# EasyEDA schematic 1-Schematic.json
TITLE: 5v 800mA USB wall wart; REV: 1.0; Date: 2017-09-17; Sheet: 1/1; Drawn By: tardate
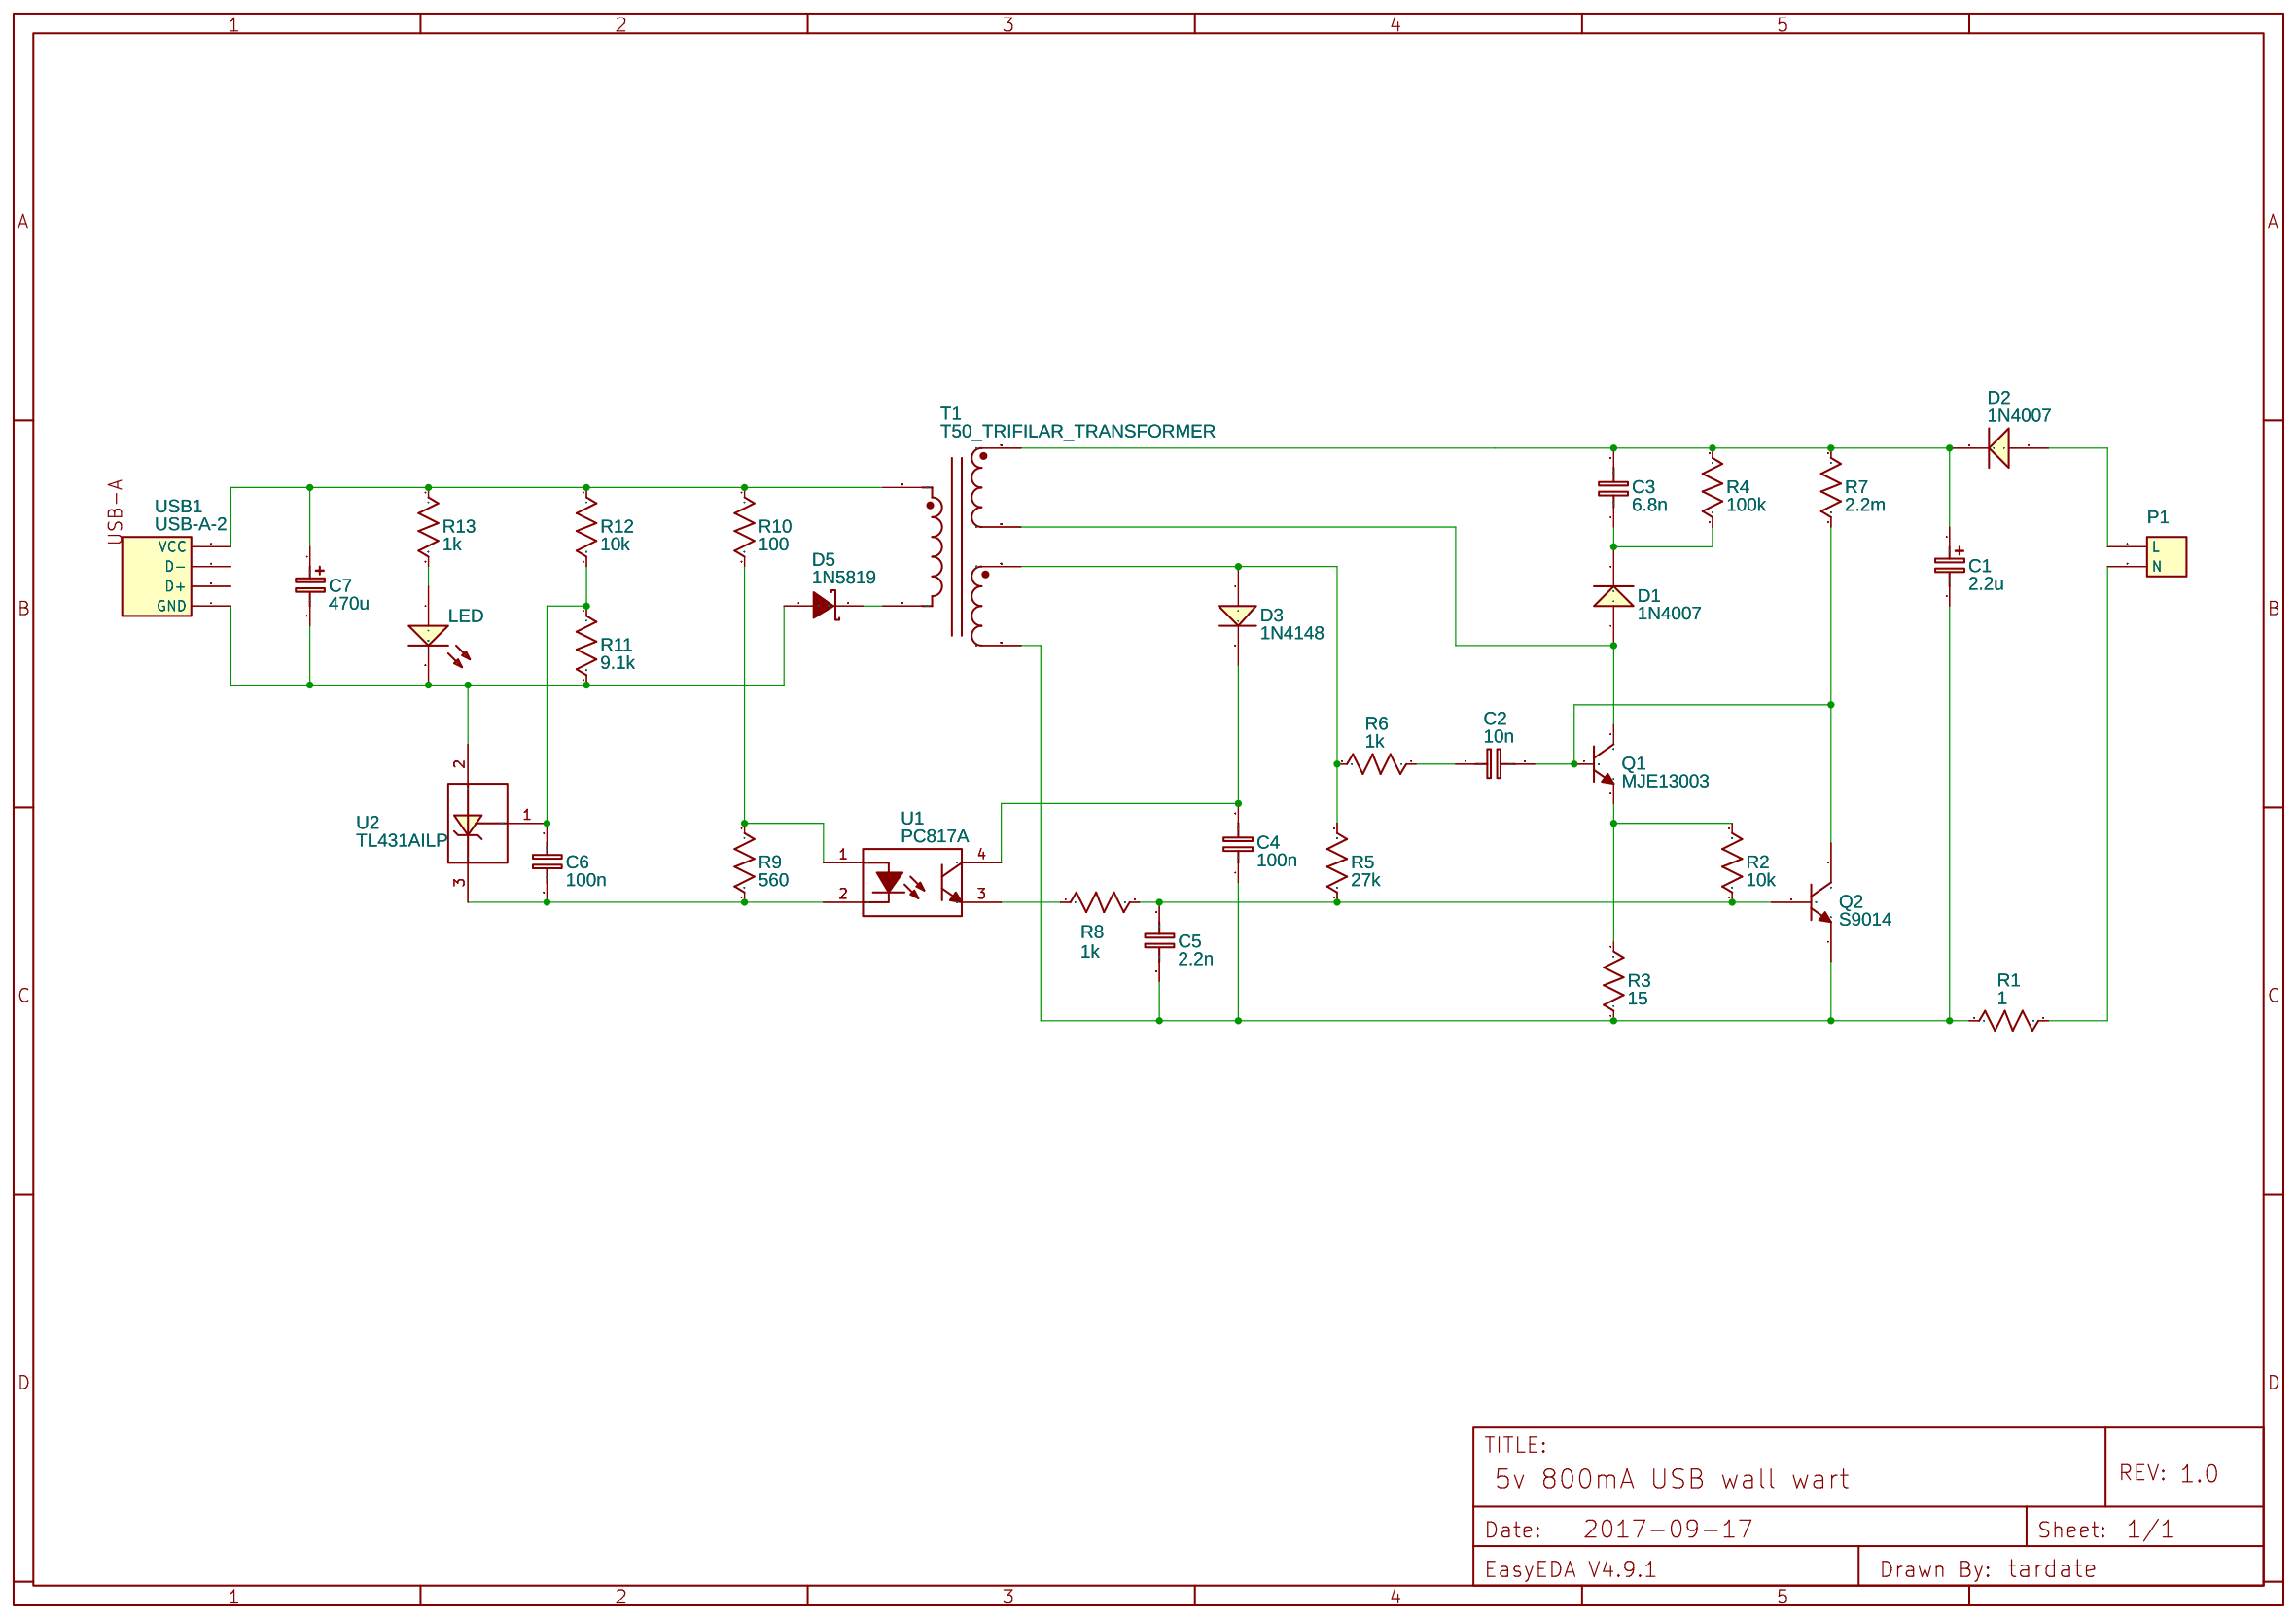
[diagram p0: schematic sheet]

## Parts
C1  2.2u  [CAP-D3.0XF1.5]
C2  10n  [RAD-0.1]
C3  6.8n  [RAD-0.1]
C4  100n  [RAD-0.1]
C5  2.2n  [RAD-0.1]
C6  100n  [RAD-0.1]
C7  470u  [CAP-D3.0XF1.5]
D1  1N4007  [DO-41]
D2  1N4007  [DO-41]
D3  1N4148  [DO-35]
D5  1N5819  [DO-41]
LED  204-10UYC/S530-A3  [LED-3MM/2.54]
P1  Header-Female-2.54_1x2  [HDR-1X2/2.54]
Q1  MJE13003  [TO-126]
Q2  S9014  [TO-92(TO-92-3)]
R1  1  [AXIAL-0.3]
R2  10k  [AXIAL-0.3]
R3  15  [AXIAL-0.3]
R4  100k  [AXIAL-0.3]
R5  27k  [AXIAL-0.3]
R6  1k  [AXIAL-0.3]
R7  2.2m  [AXIAL-0.3]
R8  1k  [AXIAL-0.3]
R9  560  [AXIAL-0.3]
R10  100  [AXIAL-0.3]
R11  9.1k  [AXIAL-0.3]
R12  10k  [AXIAL-0.3]
R13  1k  [AXIAL-0.3]
T1  T50_TRIFILAR_TRANSFORMER  [T50_TRIFILAR_TRANSFORMER]
U1  PC817A  [DIP-4]
U2  TL431AILP  [TO92-INLINE]
USB1  USB-A-2  [USB-A-2]

## Library data of the parts
C1-C7 = Capacitor: Manufacturer Part: ?
D1 D2 = -: 1.0 Ampere General Purpose Rectifier; catid: 20; Manufacturer Part: ?
D3 = -: High Conductance Fast Diode; catid: 20; Manufacturer Part: ?
D5 = -: Supplier: LCSC; LCSC: C2474; Manufacturer: MDD
LED = -: LCSC: C73643; Supplier: LCSC; Manufacturer: EVERLIGHT
P1 = -: LCSC: C49661; Supplier: LCSC; Manufacturer: LCSC
Q1 = -: Supplier: LCSC; Manufacturer: CJ; LCSC: C55218
Q2 = -: Supplier: LCSC; Manufacturer: CJ; Manufacturer Part: S9014 Tube; LCSC: C2097
R1-R13 = Resistor: Manufacturer Part: ?
T1 = -: catid: 20; Manufacturer Part: ?
U1 = -: Supplier: LCSC; Manufacturer: SHARP; Manufacturer Part: PC817X1NSZW; LCSC: C5351
U2 = -: Programmable Precision Reference; catid: 20; Manufacturer Part: ?
USB1 = -: LCSC: C2345; Supplier: LCSC; Manufacturer: LCSC

## Nets
Net-(C1-1): C1.1 C3.2 D2.2(K) R4.2 R7.1 T1.C2B
Net-(C1-2): C1.2 C4.1 C5.2 Q2.1(E) R1.1 R3.1 T1.C3A
Net-(C2-1): C2.1 R6.1
Net-(C2-2): C2.2 Q1.1(B) Q2.3(C) R7.2
Net-(C3-1): C3.1 D1.2(K) R4.1
Net-(C4-2): C4.2 D3.2(K) U1.4
Net-(C5-1): C5.1 Q2.2(B) R2.1 R5.1 R8.2
Net-(C6-1): C6.1 R11.1 R12.2 U2.1(REF)
Net-(C6-2): C6.2 R9.2 U1.2 U2.3(K)
Net-(C7-1): C7.1 R10.1 R12.1 R13.1 T1.C1B USB1.1(VCC)
Net-(C7-2): C7.2 D5.1(A) LED.2(C) R11.2 U2.2(A) USB1.4(GND)
Net-(D1-1): D1.1(A) Q1.2(C) T1.C2A
Net-(D2-1): D2.1(A) P1.1(L)
Net-(D3-1): D3.1(A) R5.2 R6.2 T1.C3B
Net-(D5-2): D5.2(K) T1.C1A
Net-(LED-1): LED.1(A) R13.2
Net-(P1-2): P1.2(N) R1.2
Net-(Q1-3): Q1.3(E) R2.2 R3.2
Net-(R8-1): R8.1 U1.3
Net-(R9-1): R9.1 R10.2 U1.1

Not connected (* = marked no-connect by the designer): USB1 2(D-) 3(D+)
